# EAGLE design Helmet_Drop_V2.0 (EAGLE 9.6.2)

## Sheet 1 of 3
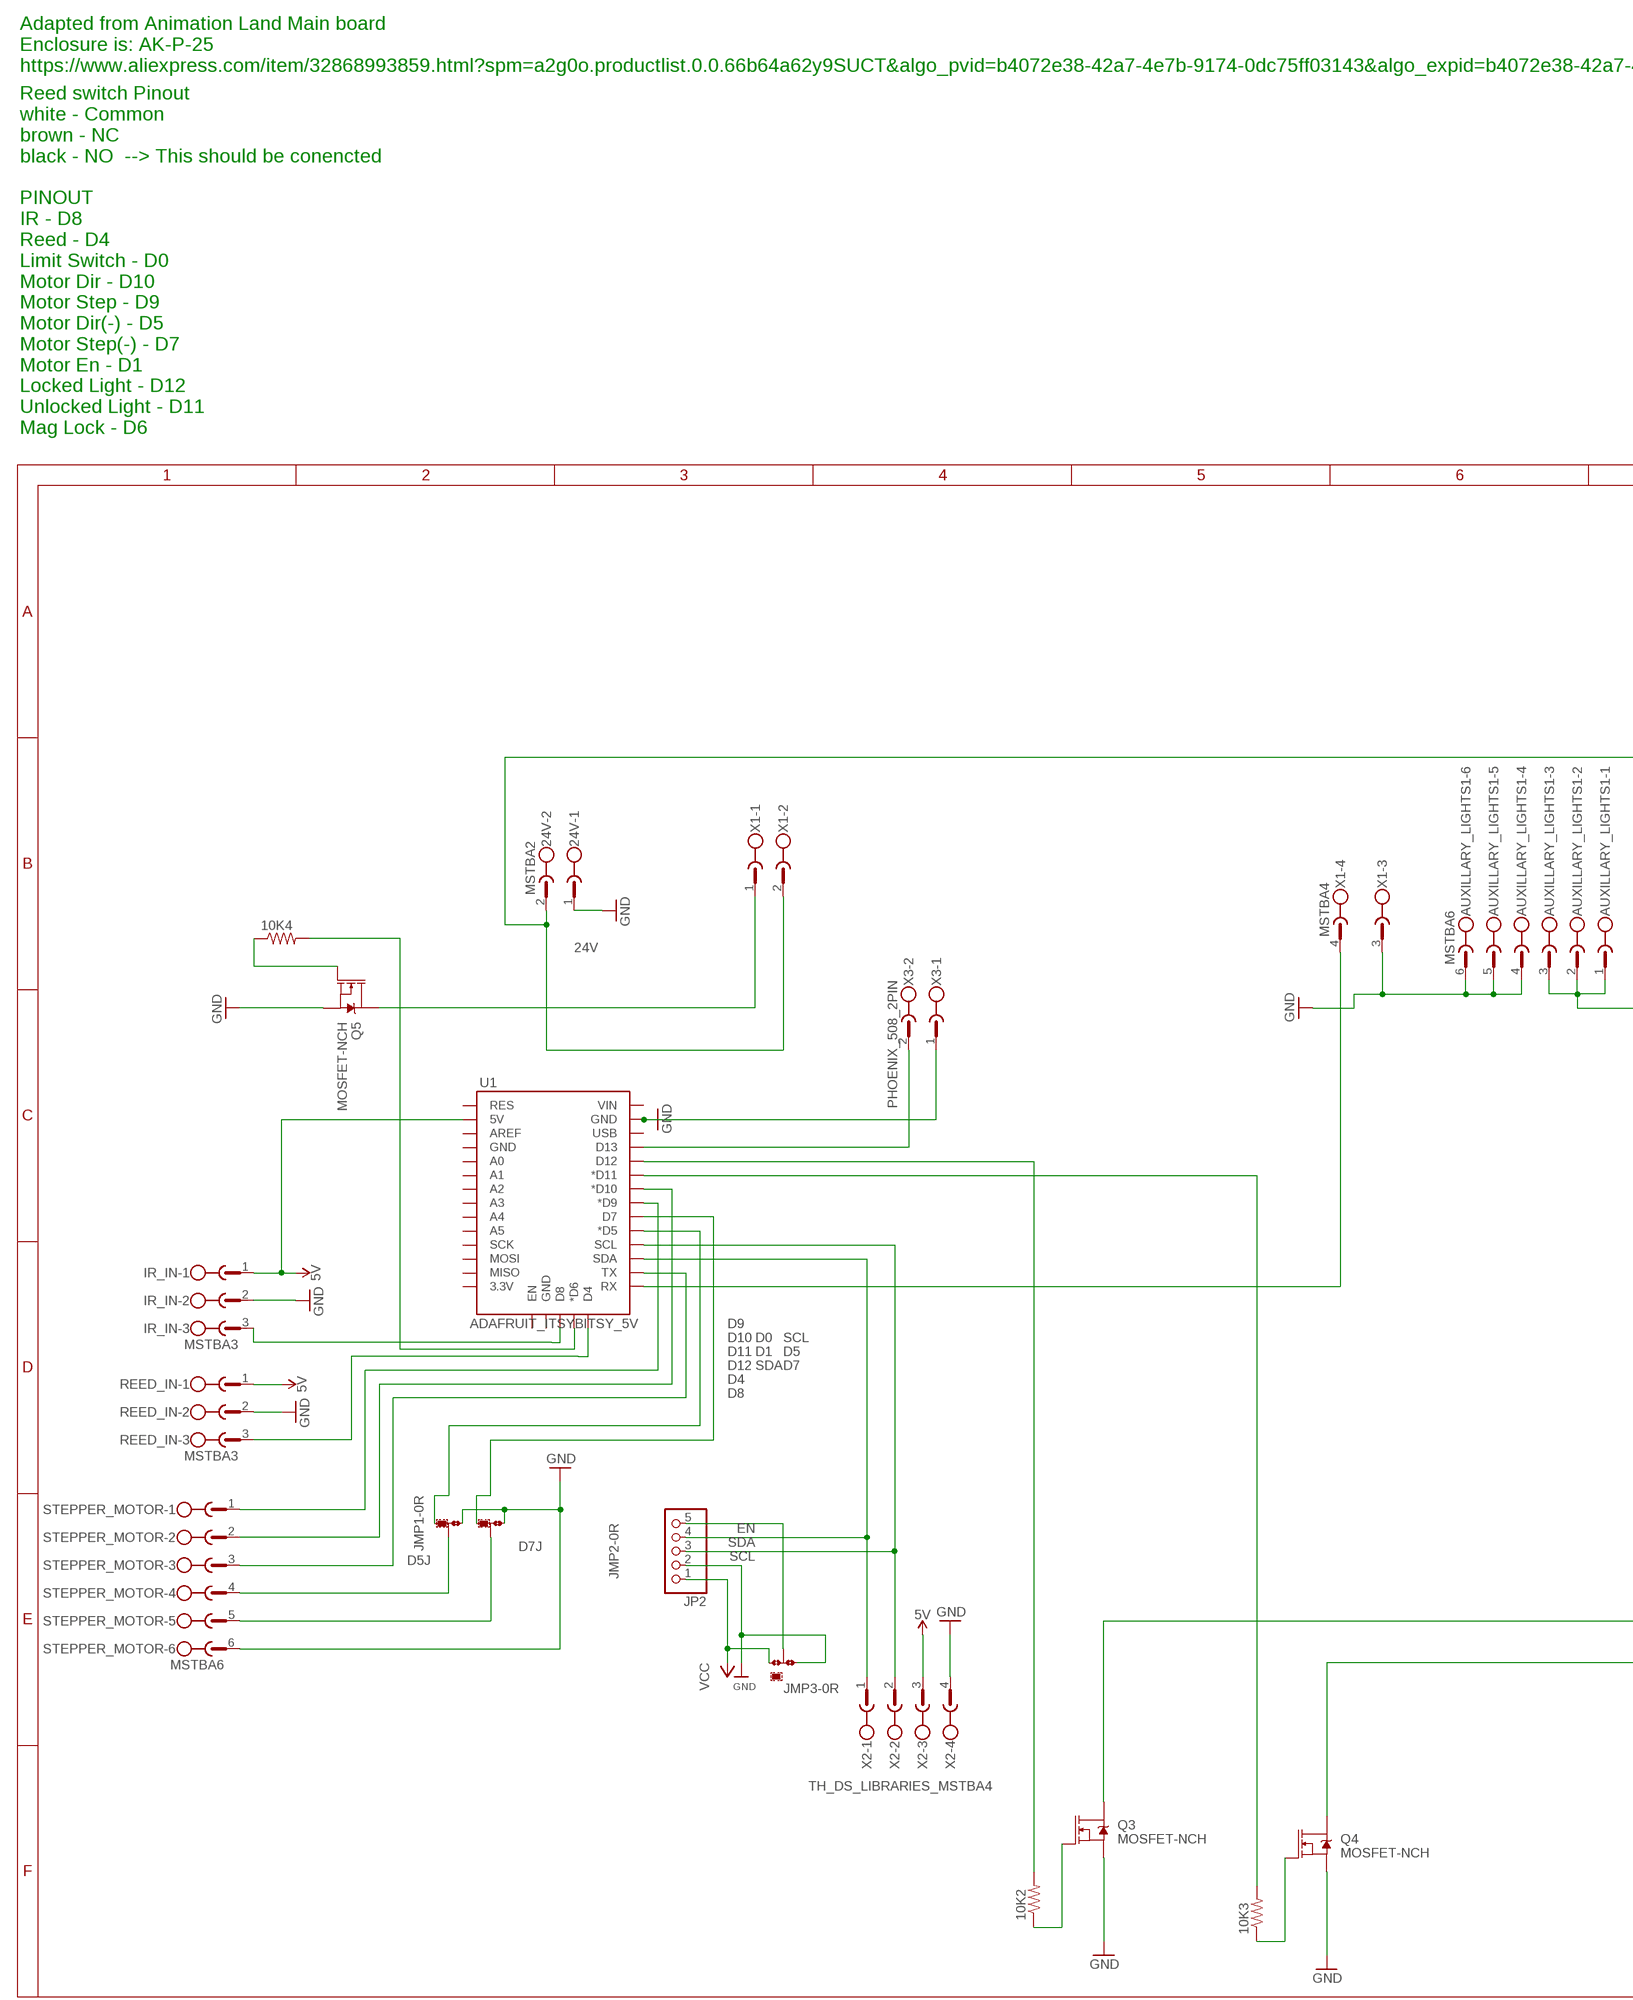
[diagram p0: schematic, sheet 1, part 1 of 2]
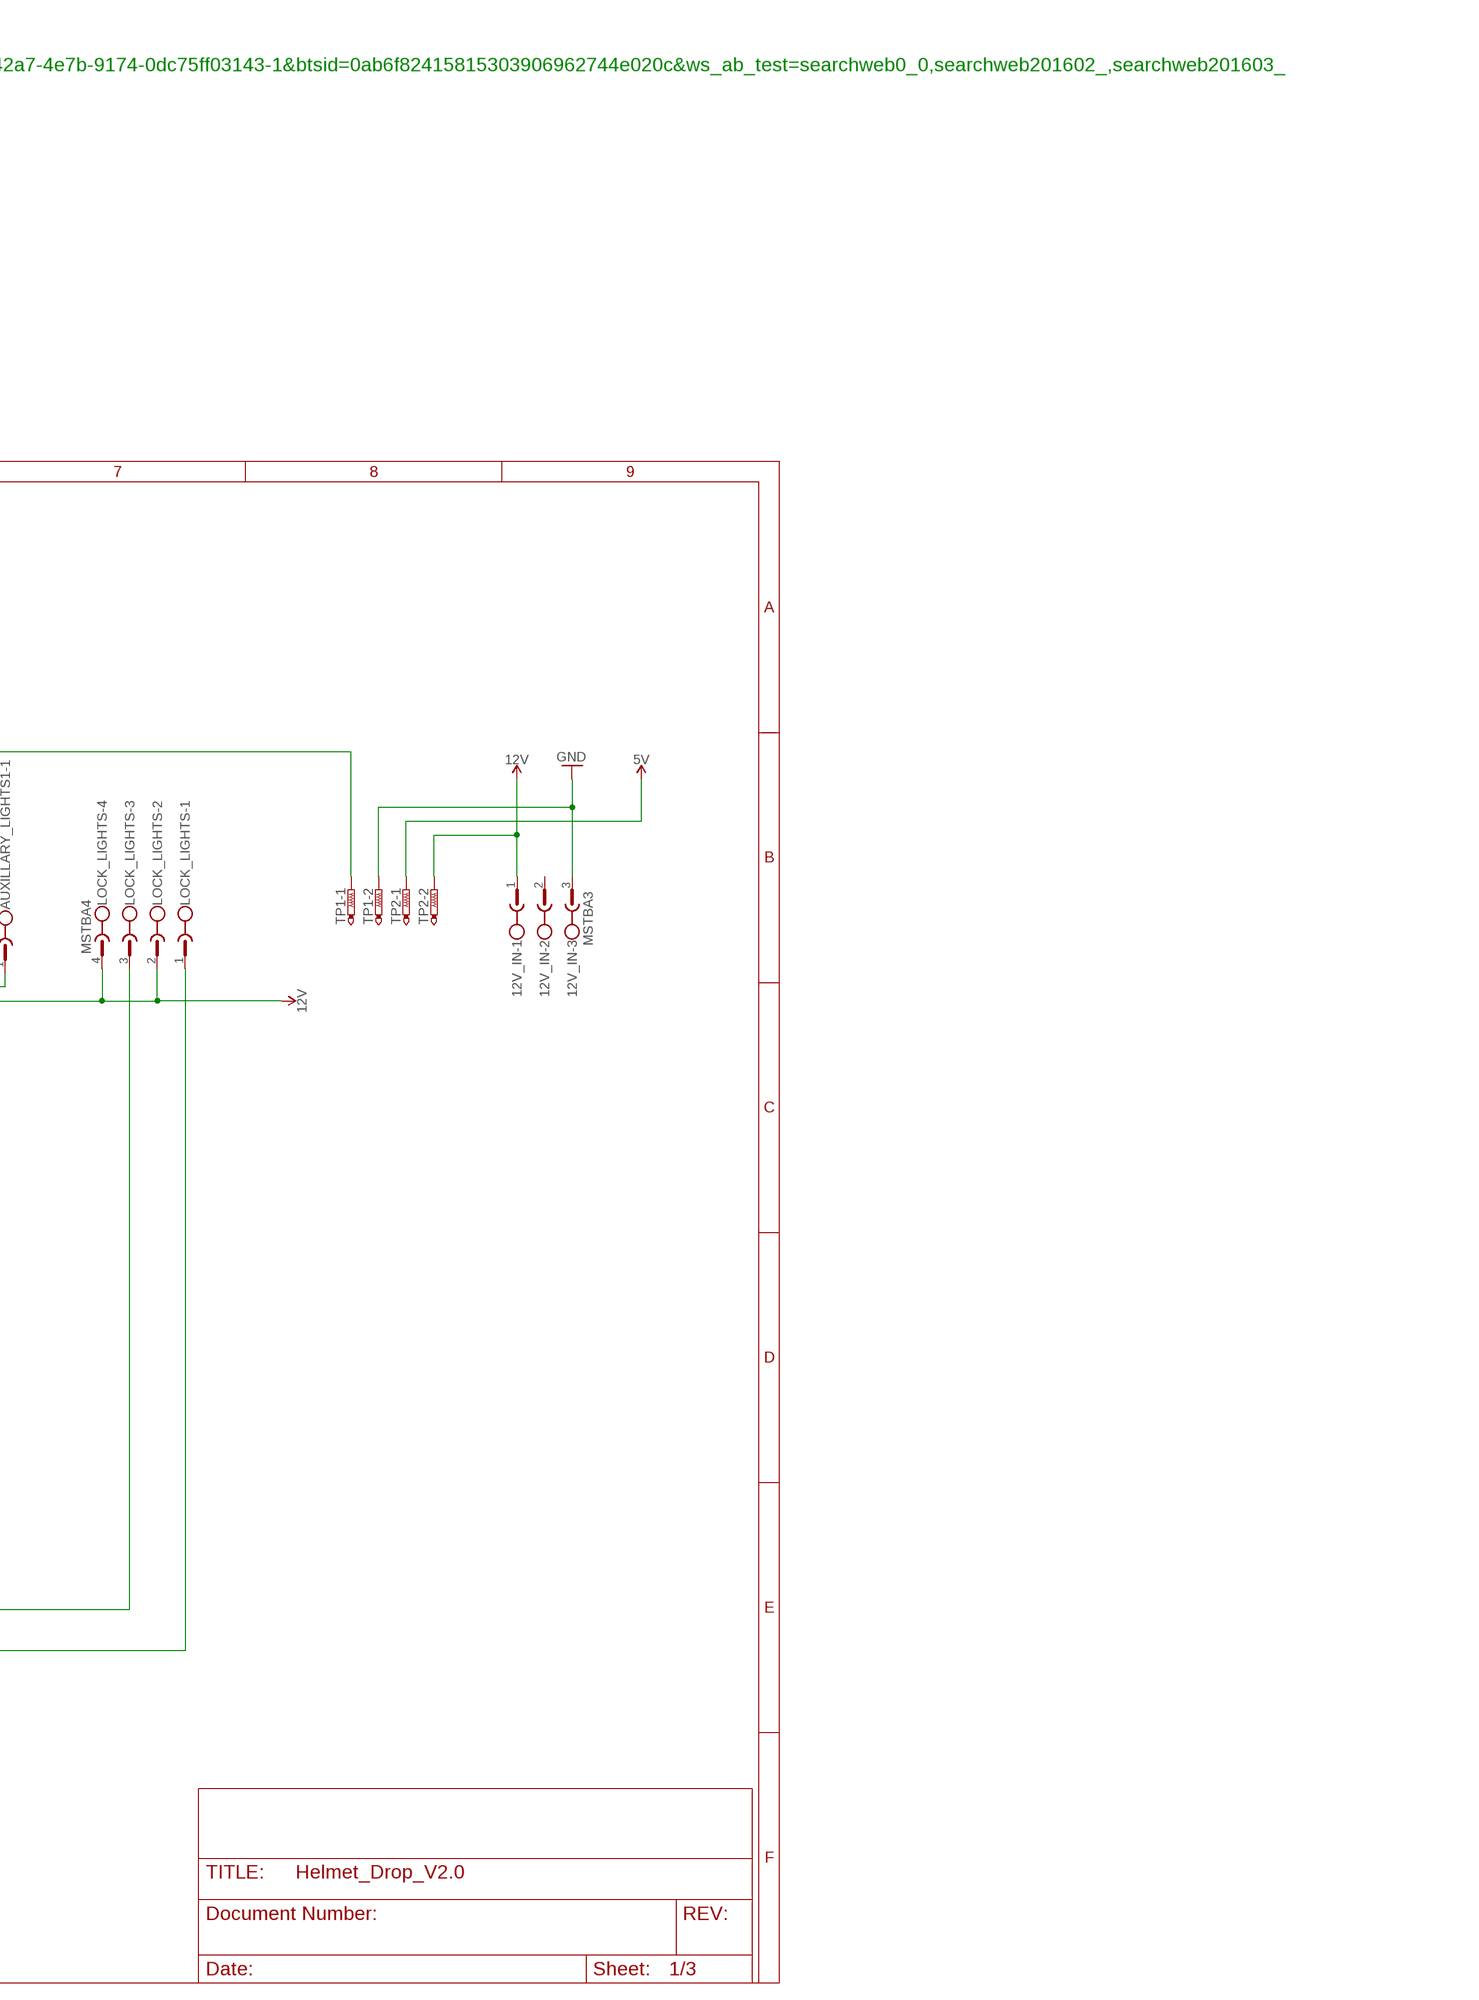
[diagram p1: schematic, sheet 1, part 2 of 2]

### Parts
10K2  R-US_M0805  [M0805]
10K3  R-US_M0805  [M0805]
10K4  R-US_M0805  [M0805]
12V_IN  MSTBA3  [MSTBA3]
24V  MSTBA2  [MSTBA2]
AUXILLARY_LIGHTS1  MSTBA6  [MSTBA6]
IR_IN  MSTBA3  [MSTBA3]
JMP1  0R-JUMPB  [B0R-JMP]
JMP2  0R-JUMPB  [B0R-JMP]
JMP3  0R-JUMPA  [A0R-JMP]
JP2  HEADER-1X570MIL  [1X05_ROUND_70]
LOCK_LIGHTS  MSTBA4  [MSTBA4]
Q3  MOSFET-NCH  [SO-8_POWER_PAK]
Q4  MOSFET-NCH  [SO-8_POWER_PAK]
Q5  MOSFET-NCH  [SO-8_POWER_PAK]
REED_IN  MSTBA3  [MSTBA3]
STEPPER_MOTOR  MSTBA6  [MSTBA6]
TP1  PTR2  [P2-38-17]
TP2  PTR2  [P2-38-17]
U1  ADAFRUIT_ITSYBITSY_5V  [ADAFRUIT_ITSYBITSY]
X1  MSTBA4  [MSTBA4]
X2  TH_DS_LIBRARIES_MSTBA4  [TH_DS_LIBRARIES_MSTBA4]
X3  PHOENIX_508_2PIN  [PHOENIX_508_2PIN]

### Nets
5V [highpower]: IR_IN.1 REED_IN.1 TP2.TP-1 U1.5V X2.3
12V [highpower]: 12V_IN.1 AUXILLARY_LIGHTS1.1 AUXILLARY_LIGHTS1.2 AUXILLARY_LIGHTS1.3 LOCK_LIGHTS.2 LOCK_LIGHTS.4 TP2.TP-2
24V [highpower]: 24V.2 TP1.TP-1 X1.2
D0 [Low Power]: U1.RX X1.4
D1 [Low Power]: STEPPER_MOTOR.3 U1.TX
D4 [Low Power]: REED_IN.3 U1.D4
D5 [Low Power]: JMP1.3 U1.D5(*D5)
D5J [Low Power]: JMP1.2 STEPPER_MOTOR.4
D7 [Low Power]: JMP2.3 U1.D7
D7J [Low Power]: JMP2.2 STEPPER_MOTOR.5
D8 [Low Power]: IR_IN.3 U1.D8
D9 [Low Power]: STEPPER_MOTOR.1 U1.D9(*D9)
D10 [Low Power]: STEPPER_MOTOR.2 U1.D10(*D10)
D11 [Low Power]: 10K3.2 U1.D11(*D11)
D12 [Low Power]: 10K2.2 U1.D12
EN [Low Power]: JMP3.2 JP2.5
GND [highpower]: 12V_IN.3 24V.1 AUXILLARY_LIGHTS1.4 AUXILLARY_LIGHTS1.5 AUXILLARY_LIGHTS1.6 IR_IN.2 JMP1.1 JMP2.1 JMP3.3 JP2.2 Q3.S Q4.S Q5.S REED_IN.2 STEPPER_MOTOR.6 TP1.TP-2 U1.GND@2(GND) X1.3 X2.4 X3.1 ; also sheet 2
N$1 [Low Power]: 10K4.2 U1.D6(*D6)
N$2: U1.D13 X3.2
N$7 [Low Power]: LOCK_LIGHTS.3 Q3.D1(D)
N$10 [Low Power]: LOCK_LIGHTS.1 Q4.D1(D)
N$12 [Low Power]: 10K2.1 Q3.G
N$21 [Low Power]: Q5.D1(D) X1.1
N$27 [Low Power]: 10K3.1 Q4.G
N$28 [Low Power]: 10K4.1 Q5.G
SCL [Low Power]: JP2.3 U1.SCL X2.2
SDA [Low Power]: JP2.4 U1.SDA X2.1
VCC [highpower]: JMP3.1 JP2.1
Unconnected: 12V_IN.2 U1.3V(3.3V) U1.A0 U1.A1 U1.A2 U1.A3 U1.A4 U1.A5 U1.AREF U1.EN U1.GND@0(GND) U1.GND@1(GND) U1.MISO U1.MOSI U1.RES U1.SCK U1.USB U1.VIN

### Notes on the sheet
- Adapted from Animation Land Main board
  Enclosure is: AK-P-25
  https://www.aliexpress.com/item/32868993859.html?spm=a2g0o.productlist.0.0.66b64a62y9SUCT&algo_pvid=b4072e38-42a7-4e7b-9174-0dc75ff03143&algo_expid=b4072e38-42a7-4e7b-9174-0dc75ff03143-1&btsid=0ab6f82415815303906962744e020c&ws_ab_test=searchweb0_0,searchweb201602_,searchweb201603_
- Reed switch Pinout
  white - Common
  brown - NC
  black - NO  --> This should be conencted
  
  PINOUT
  IR - D8
  Reed - D4
  Limit Switch - D0
  Motor Dir - D10
  Motor Step - D9
  Motor Dir(-) - D5
  Motor Step(-) - D7
  Motor En - D1
  Locked Light - D12
  Unlocked Light - D11
  Mag Lock - D6

## Sheet 2 of 3
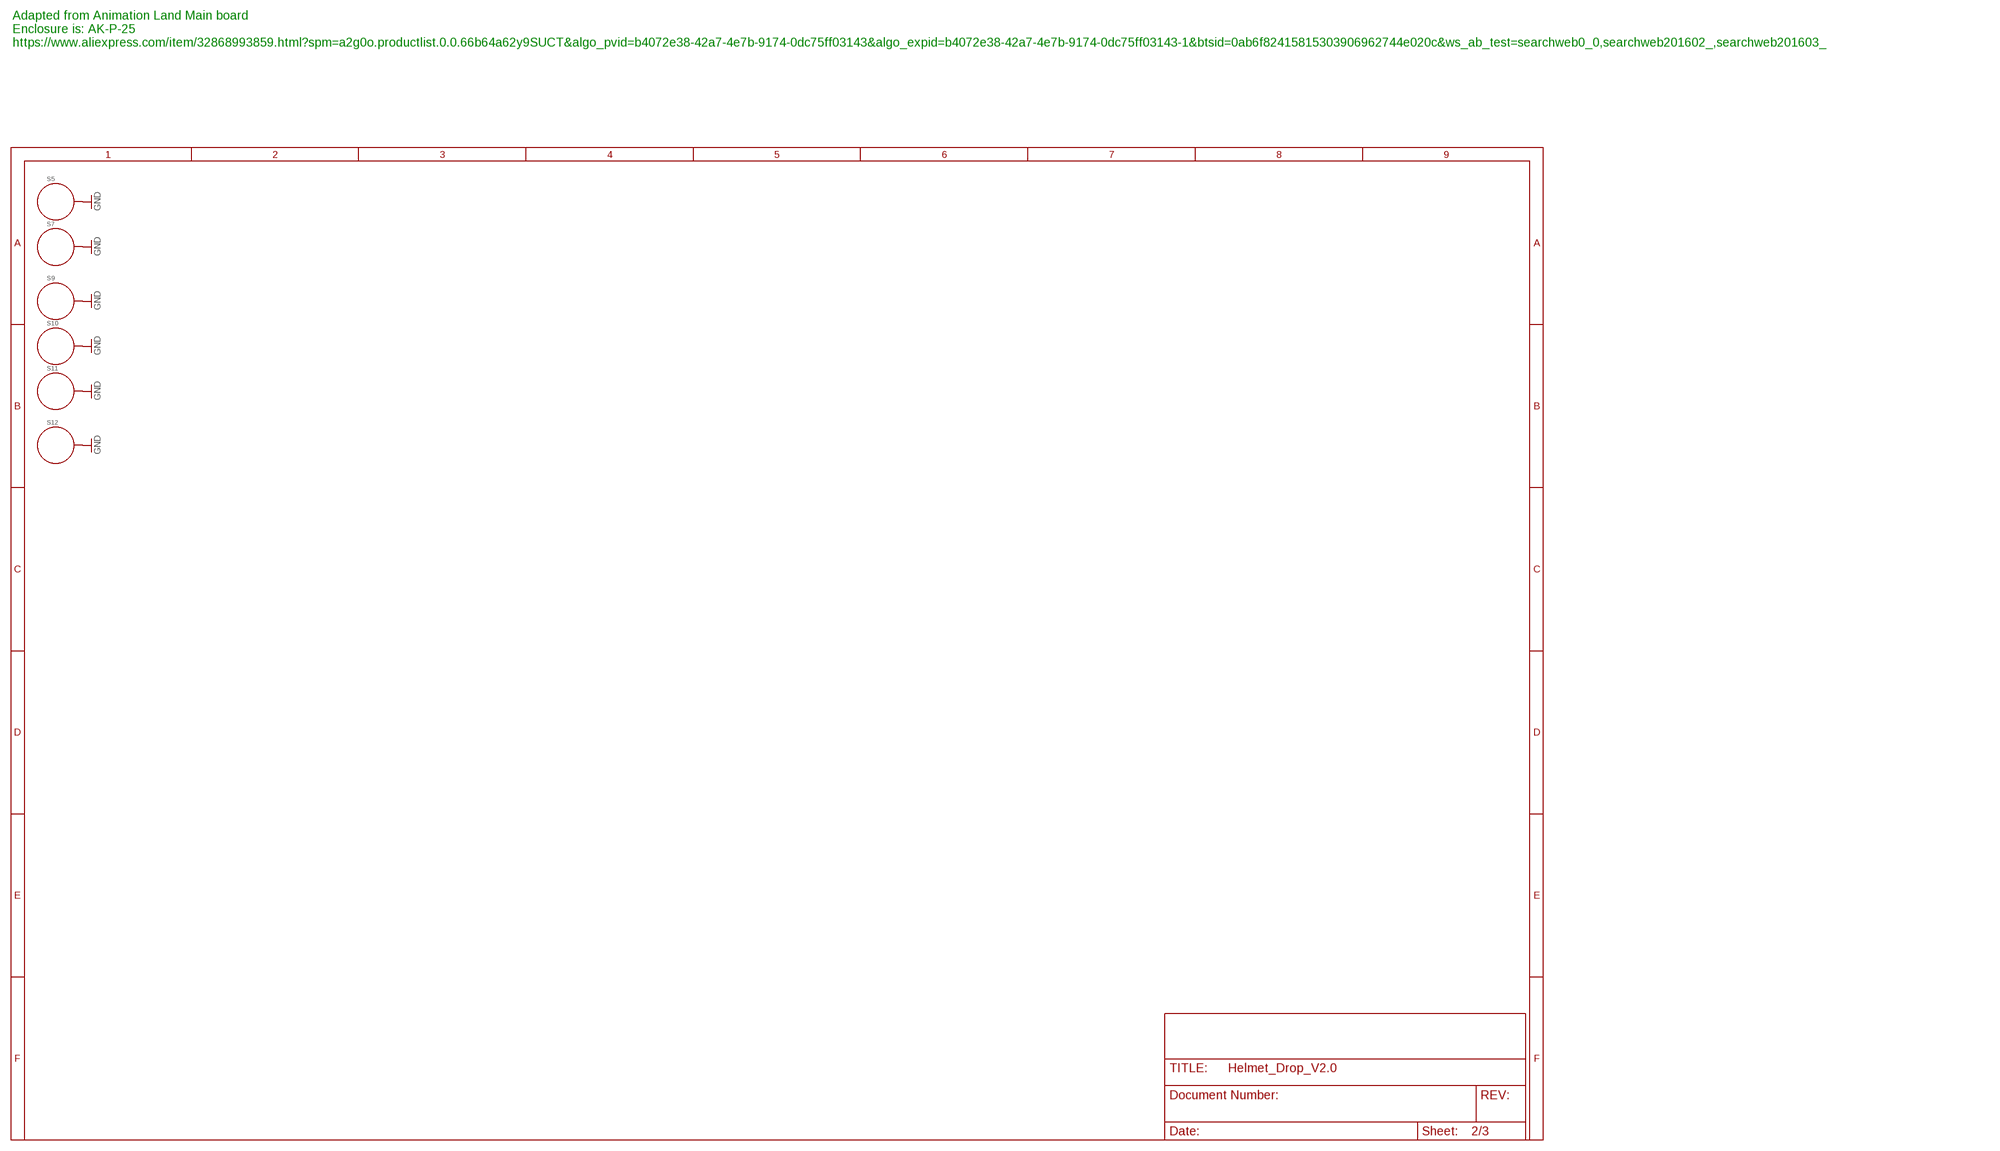
[diagram p2: schematic, sheet 2]

### Parts
S5  STANDOFF_ELECTRICAL5-32  [STANDOFF_ELECTRICAL_5_32]
S7  STANDOFF_ELECTRICAL5-32  [STANDOFF_ELECTRICAL_5_32]
S9  STANDOFF_ELECTRICAL5-32  [STANDOFF_ELECTRICAL_5_32]
S10  STANDOFF_ELECTRICAL5-32  [STANDOFF_ELECTRICAL_5_32]
S11  STANDOFF_ELECTRICAL5-32  [STANDOFF_ELECTRICAL_5_32]
S12  STANDOFF_ELECTRICAL5-32  [STANDOFF_ELECTRICAL_5_32]

### Nets
GND [highpower]: S5.P1 S7.P1 S9.P1 S10.P1 S11.P1 S12.P1 ; also sheet 1

### Notes on the sheet
- Adapted from Animation Land Main board
  Enclosure is: AK-P-25
  https://www.aliexpress.com/item/32868993859.html?spm=a2g0o.productlist.0.0.66b64a62y9SUCT&algo_pvid=b4072e38-42a7-4e7b-9174-0dc75ff03143&algo_expid=b4072e38-42a7-4e7b-9174-0dc75ff03143-1&btsid=0ab6f82415815303906962744e020c&ws_ab_test=searchweb0_0,searchweb201602_,searchweb201603_

## Sheet 3 of 3
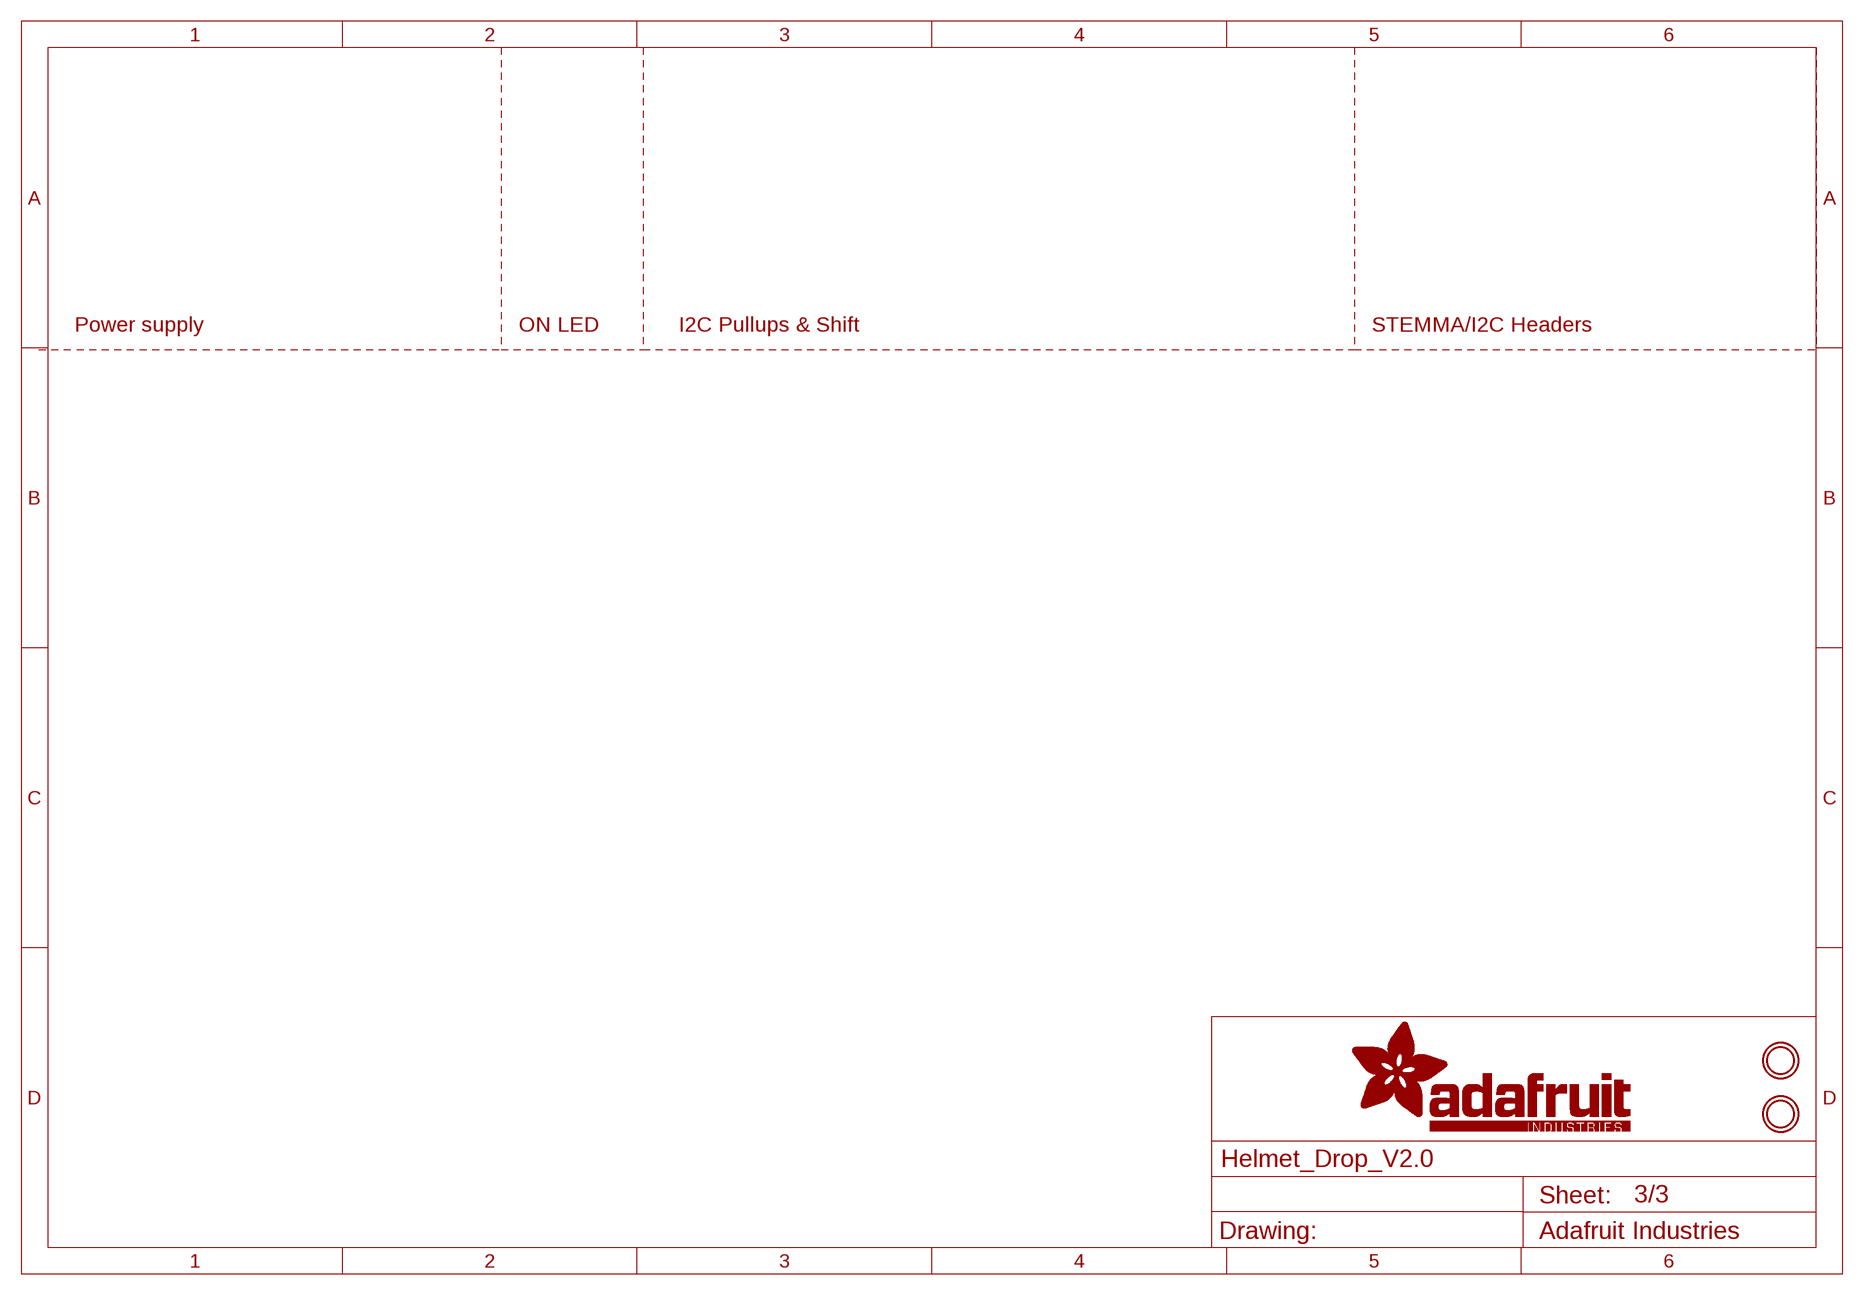
[diagram p3: schematic, sheet 3]

### Parts
U$19  MOUNTINGHOLE2.5  [MOUNTINGHOLE_2.5_PLATED]
U$21  MOUNTINGHOLE2.5  [MOUNTINGHOLE_2.5_PLATED]

### Notes on the sheet
- Power supply | ON LED | I2C Pullups & Shift | STEMMA/I2C Headers

## Library data of the parts
10K2-10K4 = adafruit:R-US_: RESISTOR, American symbol
12V_IN IR_IN REED_IN = con-phoenix-508:MSTBA3: PHOENIX; MF: FARNELL; MPN: 1757255; OC_FARNELL: 3705183; OC_NEWARK: 71C4162
24V = th_libraries:MSTBA2: PHOENIX; MF: FARNELL; MPN: 1757242; OC_FARNELL: 3705171; OC_NEWARK: 71C4161
AUXILLARY_LIGHTS1 STEPPER_MOTOR = con-phoenix-508:MSTBA6: PHOENIX; MF: FARNELL; MPN: 1757284; OC_FARNELL: 3705213; OC_NEWARK: 71C4165
JMP1-JMP3 = jump-0r-smd:0R-JUMP: SMD 0R 0805 Jumper
JP2 = microbuilder:HEADER-1X5: PIN HEADER
LOCK_LIGHTS = th_libraries:MSTBA4: PHOENIX; MF: FARNELL; MPN: 1757268; OC_FARNELL: 3705195; OC_NEWARK: 71C4163
Q3-Q5 = th_ds_libraries:MOSFET-NCH: N-channel MOSFETs from Sparkfun-DiscreteSemi Library
S5 S7 S9-S12 = th_libraries:STANDOFF_ELECTRICAL: A standoff intended to be an electrically connected point. Pad size and stop size allow for a #8 Phillips pan screw head to make a solid connection to the board. Added 144mill drill hole that fits my normal wood screw
TP1 TP2 = testpad:PTR2: TEST PIN
U1 = OMSI_Default_V1:ADAFRUIT_ITSYBITSY_5V: Adafruit ItsyBitsy 32u4 - 5V 16MHz https://www.adafruit.com/product/3677
U$19 U$21 = microbuilder:MOUNTINGHOLE: Mounting Hole For #2 screws (0.086"/2.18mm width, 0.094"/2.4mm hole) use 2.5mm; BOM: EXCLUDE
X1 = con-phoenix-508:MSTBA4: PHOENIX; MF: FARNELL; MPN: 1757268; OC_FARNELL: 3705195; OC_NEWARK: 71C4163
X2 = OMSI_Default_V1:TH_DS_LIBRARIES_MSTBA4: PHOENIX; MF: FARNELL; MPN: 1757268; OC_FARNELL: 3705195; OC_NEWARK: 71C4163
X3 = OMSI_Default_V1:PHOENIX_508_2PIN: PHOENIX; MF: FARNELL; MPN: 1757242; OC_FARNELL: 3705171; OC_NEWARK: 71C4161

## Net classes
1 highpower: width 0.635 mm, drill 0.483 mm, clearance 0.127 mm
2 Low Power: width 0.254 mm, drill 0.483 mm

## Board
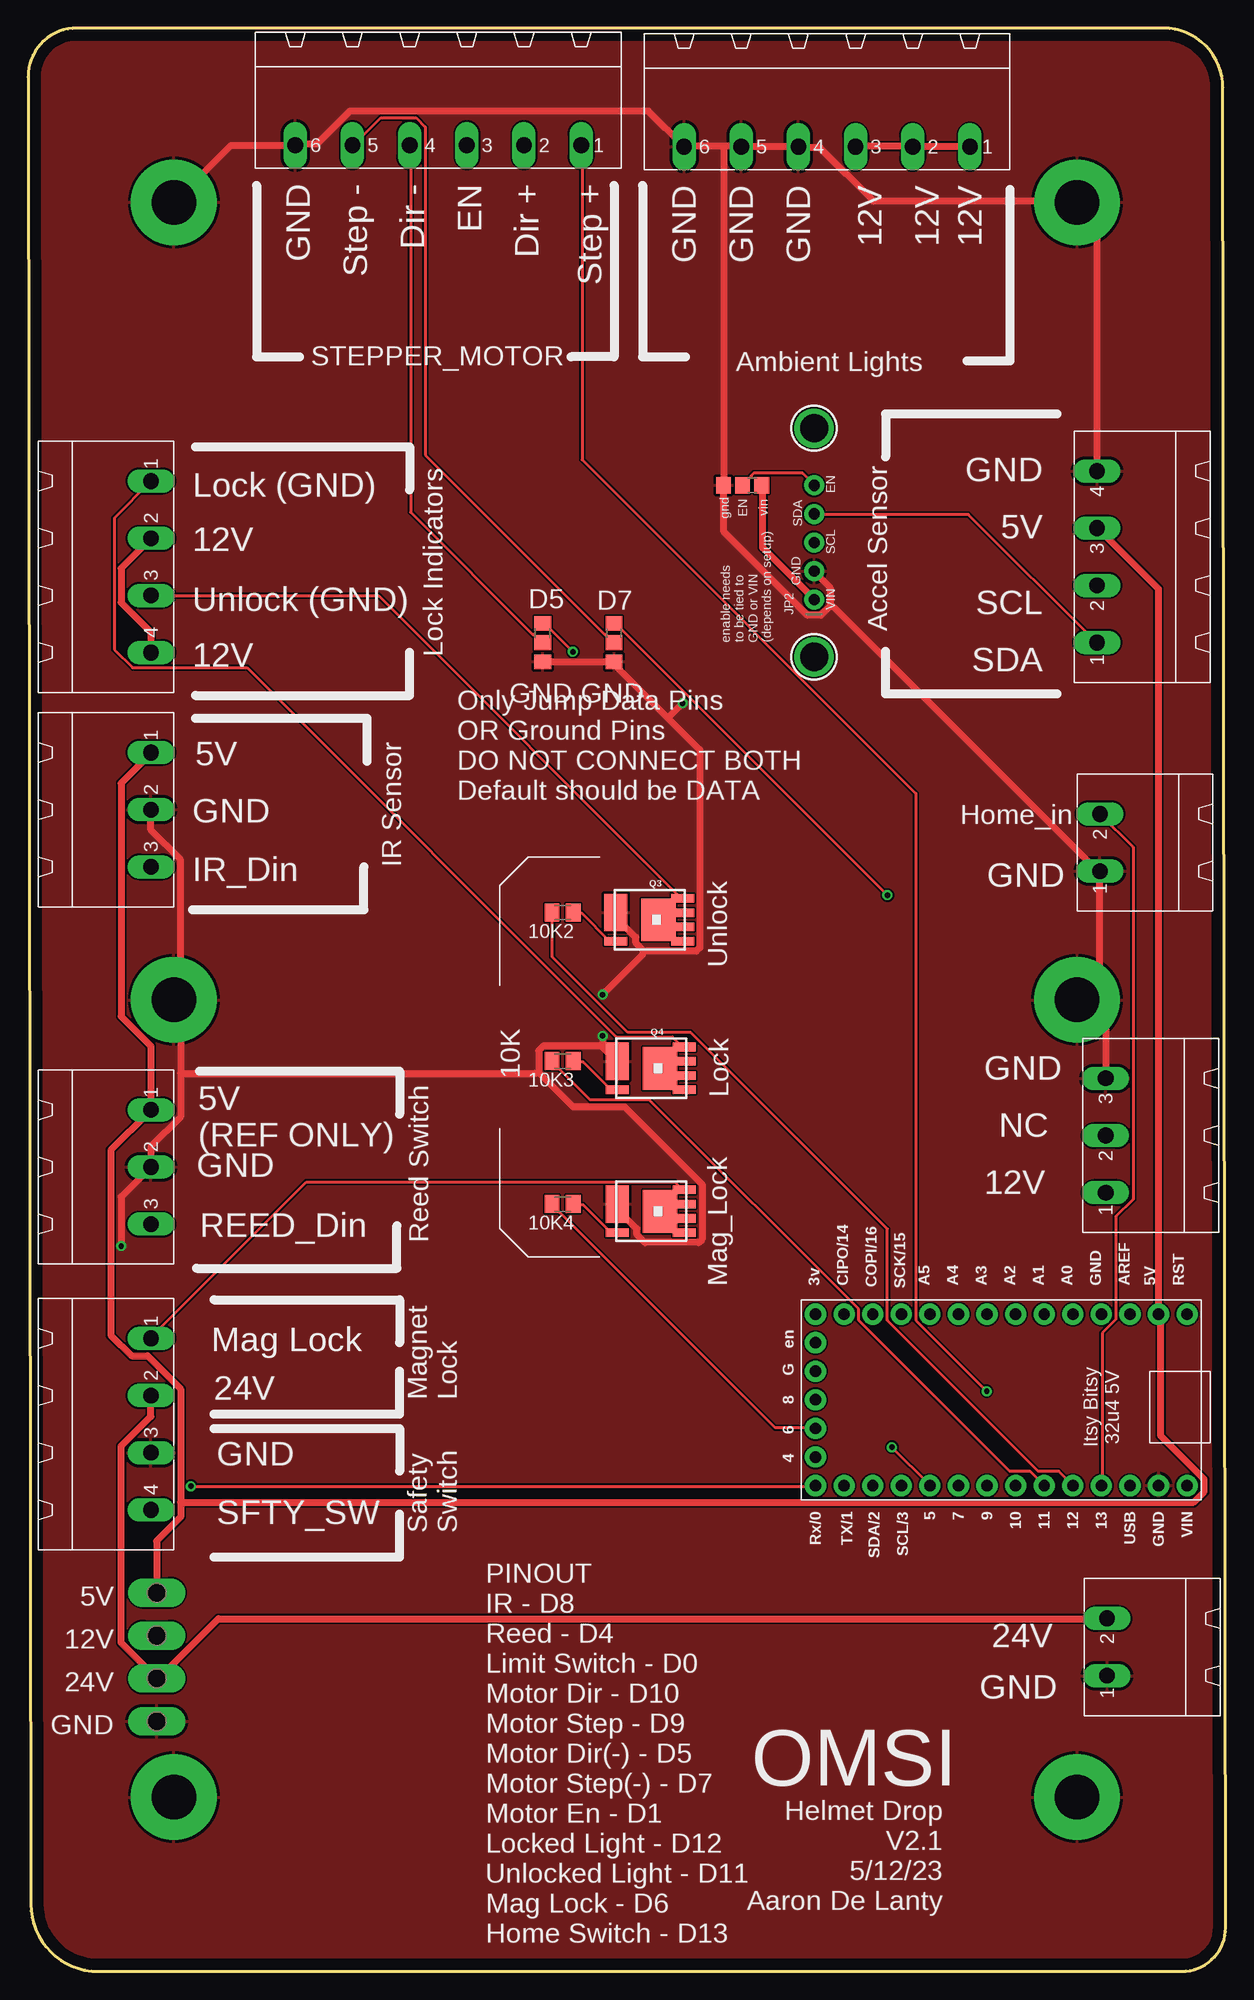
[diagram p4: board, top side]
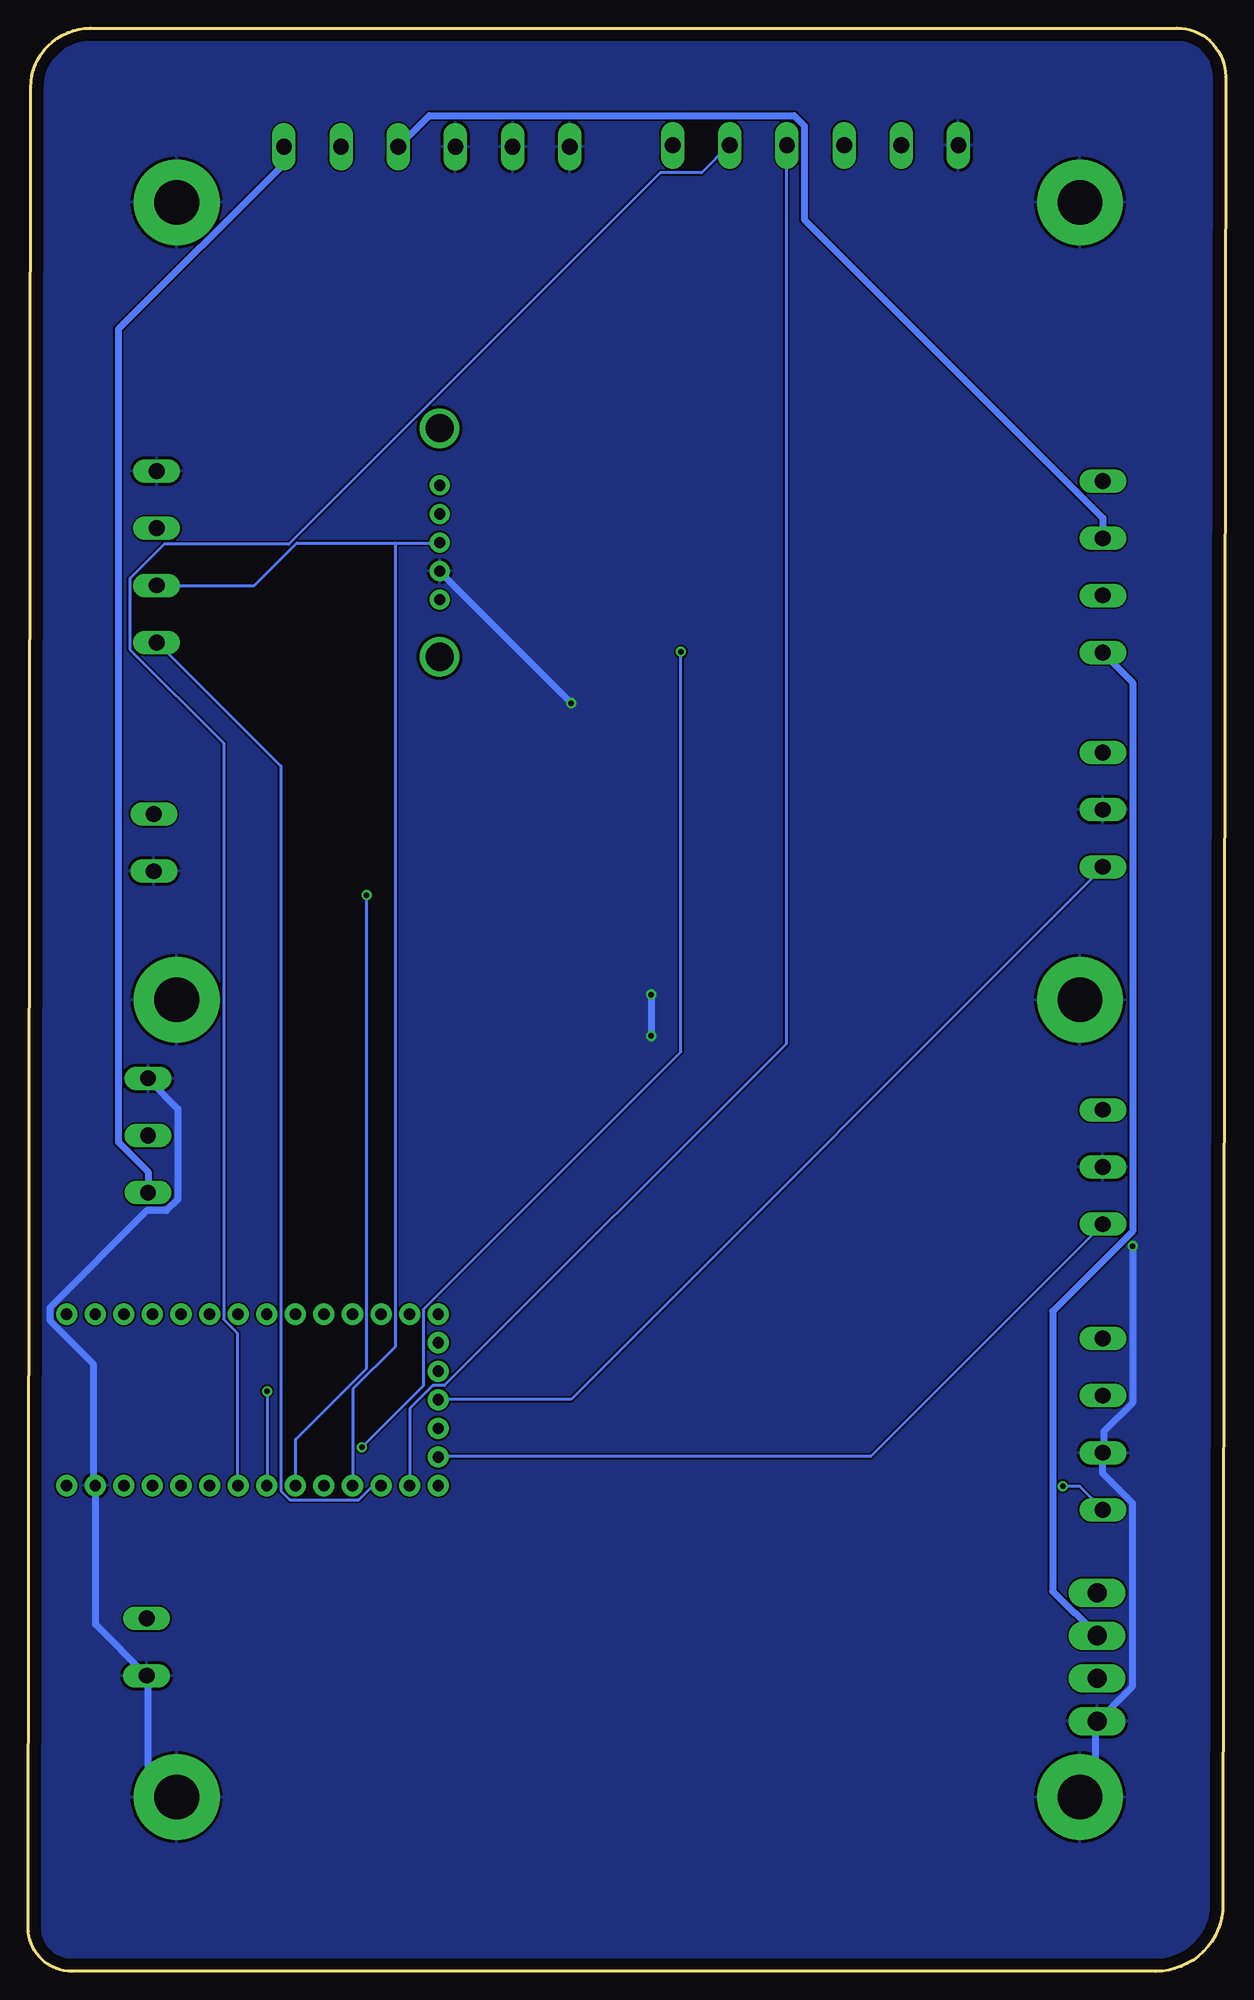
[diagram p5: board, bottom side, seen from below]

Size 106.41 x 172.72 mm. Coordinates in mm from the lower left corner, seen from the top.
Outline: 106.41,3.89 106.17,167.44 arc90 100.89,172.72 4.33,172.72 arc90 0,168.39 0.24,5.97 arc90 6.22,0 102.53,0 arc90 106.41,3.89
Copper layers (1*16): Top 0.035mm / dielectric 1.5mm / Bottom 0.035mm
Design rules "default *": minimum track width 10mil, minimum drill 0.35mm, track to track 6mil, track to pad 6mil, pad to pad 6mil, via to via 6mil, smd to smd 6mil, copper to edge 40mil, drill to drill 6mil, minimum pad ring 10mil, minimum via ring 8mil, stop-mask expansion 4mil, vias tented up to drill 0mil, thermal gap 10mil

### Footprints (pad centres in the part's own frame; a part is rotated, then mirrored left to right if it is on the bottom)
M0805 = smd 1.3 x 1.6: 1 -0.95,0; 2 0.95,0
MSTBA3 = drill 1.397 long: 1 -5.08,5.08; 2 0,5.08; 3 5.08,5.08
MSTBA2 = drill 1.397 long: 1 -2.54,5.08; 2 2.54,5.08
MSTBA6 = drill 1.397 long: 1 -12.7,5.08; 2 -7.62,5.08; 3 -2.54,5.08; 4 2.54,5.08; 5 7.62,5.08; 6 12.7,5.08
B0R-JMP = smd 1.5 x 1.3: 1 0,1.7; 2 0,0; 3 0,-1.7
A0R-JMP = smd 1.5 x 1.3: 1 0,1.7; 2 0,0; 3 0,-1.7
1X05_ROUND_70 = drill 1 pad 1.778: 1 -5.08,0; 2 -2.54,0; 3 0,0; 4 2.54,0; 5 5.08,0
MSTBA4 = drill 1.397 long: 1 -7.62,5.08; 2 -2.54,5.08; 3 2.54,5.08; 4 7.62,5.08
SO-8_POWER_PAK = smd 0.762 x 2.032: D1 -3.423,2.437; D2 -2.153,2.437; D3 -0.883,2.437; D4 0.387,2.437; G 0.387,-3.532 | smd 3.81 x 3.048: D5 -1.518,0.278 | smd 3.302 x 2.032: S -2.153,-3.532
STANDOFF_ELECTRICAL_5_32 = drill 3.969 pad 7.62: P1 0,0
P2-38-17 = drill 1.702 pad 2.121 long: TP-1 -1.905,0; TP-2 1.905,0
ADAFRUIT_ITSYBITSY = drill 1.016 pad 1.88: 3V -7.62,-16.51; 5V -7.62,13.97; A0 -7.62,6.35; A1 -7.62,3.81; A2 -7.62,1.27; A3 -7.62,-1.27; A4 -7.62,-3.81; A5 -7.62,-6.35; AREF -7.62,11.43; D4 5.08,-16.51; D5 7.62,-6.35; D6 2.54,-16.51; D7 7.62,-3.81; D8 0,-16.51; D9 7.62,-1.27; D10 7.62,1.27; D11 7.62,3.81; D12 7.62,6.35; D13 7.62,8.89; EN -5.08,-16.51; GND@0 -7.62,8.89; GND@1 -2.54,-16.51; GND@2 7.62,13.97; MISO -7.62,-13.97; MOSI -7.62,-11.43; RES -7.62,16.51; RX 7.62,-16.51; SCK -7.62,-8.89; SCL 7.62,-8.89; SDA 7.62,-11.43; TX 7.62,-13.97; USB 7.62,11.43; VIN 7.62,16.51
MOUNTINGHOLE_2.5_PLATED = drill 2.5 pad 3.2: P$1 0,0
TH_DS_LIBRARIES_MSTBA4 = drill 1.397 long: 1 -7.62,5.08; 2 -2.54,5.08; 3 2.54,5.08; 4 7.62,5.08
PHOENIX_508_2PIN = drill 1.397 long: 1 -2.54,5.08; 2 2.54,5.08

### Placement (x,y rotation side)
10K2  47.49,94.11 180 top
10K3  47.49,80.9 180 top
10K4  47.49,68.2 180 top
12V_IN  100.83,74.3 90 top
24V  100.96,28.83 90 top
AUXILLARY_LIGHTS1  70.99,167.26 180 top
IR_IN  5.84,103.25 270 top
JMP1  45.71,118.11 180 top
JMP2  52.06,118.11 180 top
JMP3  63.49,132.08 270 top
JP2  69.84,127 90 top
LOCK_LIGHTS  5.84,124.84 270 top
Q3  55.75,91.95 270 top
Q4  55.87,78.74 270 top
Q5  55.87,66.04 270 top
REED_IN  5.84,71.5 270 top
S5  93.21,157.23 270 top
S7  12.95,86.36 270 top
S9  12.95,157.23 270 top
S10  93.21,86.36 270 top
S11  12.95,15.49 270 top
S12  93.21,15.49 270 top
STEPPER_MOTOR  36.44,167.39 180 top
TP1  11.42,24.13 270 top
TP2  11.42,31.75 270 top
U1  86.48,50.8 270 top
U$19  69.84,116.84 90 top
U$21  69.84,137.16 90 top
X1  5.84,48.64 270 top
X2  100.07,125.73 90 top
X3  100.32,100.33 90 top

### Tracks (layer width: path | path; a pad name or v marks a point on that pad's centre or on a via)
5V
  Top 0.635: X2.3 95.04,128.27 100.43,122.89 100.43,58.47 U1.5V 100.63,58.17 100.63,47.6 104.49,43.74 104.49,42.62 103.57,41.71 13.56,41.71 | IR_IN.1 10.92,108.26 8.27,105.61 8.27,84.89 10.92,82.25 REED_IN.1 10.71,76.35 7.36,73 7.36,56.54 9.19,54.71 10.61,54.71 13.56,51.76 13.56,41.71 | TP2.TP-1 11.42,38.25 13.56,40.39 13.56,41.71
12V
  Top 0.635: LOCK_LIGHTS.4 10.92,119.02 8.27,121.67 8.27,124.71 10.92,127.36 LOCK_LIGHTS.2 | AUXILLARY_LIGHTS1.3 73.6,162.2 78.58,162.2 AUXILLARY_LIGHTS1.2 78.89,162.2 83.66,162.2 AUXILLARY_LIGHTS1.1
  Bottom 0.635: TP2.TP-2 11.42,29.92 13.35,31.85 13.46,31.85 15.39,33.78 15.39,58.67 8.27,65.79 8.27,114.55 10.92,117.2 LOCK_LIGHTS.4 | 12V_IN.1 95.75,71.07 98.39,73.71 98.39,145.95 83.76,160.58 83.76,162.1 AUXILLARY_LIGHTS1.1 | LOCK_LIGHTS.2 10.92,129.18 37.43,155.7 37.43,164.03 38.35,164.95 70.76,164.95 AUXILLARY_LIGHTS1.3
24V
  Top 0.635: X1.2 10.92,49.33 8.27,46.68 8.27,29.21 11.42,26.06 TP1.TP-1 11.73,26.16 16.91,31.34 95.85,31.34 24V.2
D0  (via drill 0.48)
  Top 0.254: v14.47,43.13 69.95,43.13 U1.RX
  Bottom 0.254: v14.47,43.13 12.95,43.13 10.92,41.1 X1.4
D1
  Bottom 0.254: U1.TX 72.49,43.23 72.49,50.04 70.45,52.07 69.44,52.07 39.06,82.45 39.06,162.31 STEPPER_MOTOR.3
D4
  Bottom 0.254: U1.D4 69.95,45.77 31.54,45.77 10.92,66.4 REED_IN.3
D5  (via drill 0.48)
  Top 0.254: v48.41,117.3 45.97,119.74 45.76,119.74 JMP1.3 | v76.75,46.58 80.11,43.23 U1.D5
  Bottom 0.254: v48.41,117.3 48.41,81.74 71.27,58.88 71.27,52.07 v76.75,46.58
D5J
  Top 0.254: JMP1.2 45.66,118.11 44.95,118.82 44.85,118.82 33.98,129.69 33.98,162.31 STEPPER_MOTOR.4
D7  (via drill 0.48)
  Top 0.254: v76.35,95.66 52.27,119.74 52.06,119.74 JMP2.3
  Bottom 0.254: v76.35,95.66 76.35,53.59 82.65,47.29 82.65,43.23 U1.D7
D7J
  Top 0.254: JMP2.2 51.35,118.82 51.25,118.82 35.3,134.77 35.3,163.93 34.49,164.74 31.34,164.74 28.9,162.31 STEPPER_MOTOR.5
D8
  Bottom 0.254: U1.D8 69.95,50.85 58.16,50.85 10.92,98.09 IR_IN.3
D9  (via drill 0.48)
  Top 0.254: v85.19,51.56 78.89,57.86 78.89,104.7 49.22,134.37 49.22,162.31 STEPPER_MOTOR.1
  Bottom 0.254: v85.19,51.56 85.19,43.23 U1.D9
D10
  Bottom 0.254: U1.D10 87.83,43.23 87.83,56.74 89.05,57.96 89.05,109.17 97.38,117.5 97.38,123.8 94.33,126.85 83.25,126.85 50.23,159.87 46.58,159.87 44.14,162.31 STEPPER_MOTOR.2
D11
  Top 0.254: 10K3.2 46.58,80.82 49.93,77.47 55.21,77.47 73.81,58.88 73.81,57.86 87.22,44.45 89.05,44.45 90.27,43.23 U1.D11
D12
  Top 0.254: 10K2.2 46.58,94.03 46.58,90.17 53.28,83.46 58.87,83.46 76.35,65.99 76.35,57.86 89.76,44.45 91.59,44.45 92.81,43.23 U1.D12
EN
  Top 0.254: JMP3.2 64.26,132.84 64.26,132.94 64.46,133.15 68.83,133.15 69.84,132.13 JP2.5
GND  (via drill 0.48)
  Top 0.635: 45.36,79.91 48.41,76.86 52.98,76.86 59.89,69.95 59.89,65.08 59.58,64.77 54.81,64.77 54.1,65.48 54.1,65.99 52.37,67.72 52.37,68.12 Q5.S | 45.36,79.91 45.36,81.84 45.76,82.25 50.95,82.25 | 50.95,82.25 52.27,80.92 Q4.S | 13.56,79.81 13.56,85.7 12.95,86.31 S7.P1 13.05,86.61 13.56,87.12 13.56,98.81 10.92,101.45 IR_IN.2 | 13.56,79.81 13.56,75.95 10.92,73.3 REED_IN.2 10.71,71.27 8.27,68.83 v8.27,64.47 | 13.56,79.81 45.05,79.81 45.36,79.91 | 12V_IN.3 95.75,83.77 93.21,86.31 S10.P1 93.31,86.61 95.24,88.54 X3.1 94.94,97.89 71.57,121.26 71.27,121.36 | S9.P1 18.03,162.31 STEPPER_MOTOR.6 24.02,162.41 25.65,162.41 28.59,165.35 55.11,165.35 AUXILLARY_LIGHTS1.6 58.36,162.2 61.82,162.2 | JMP1.1 45.76,116.38 52.06,116.38 JMP2.1 52.17,116.08 56.84,111.4 | 54.71,90.68 53.99,91.39 53.99,91.9 52.27,93.62 52.27,94.03 Q3.S | 54.71,90.68 59.38,90.68 59.68,90.98 59.68,108.56 56.84,111.4 | 71.27,121.36 70.45,120.55 69.23,120.55 61.82,127.97 61.82,132.03 JMP3.3 61.82,132.33 61.82,162.2 | 71.27,121.36 71.27,122.99 69.84,124.41 JP2.2 | 61.82,162.2 63.34,162.2 AUXILLARY_LIGHTS1.5 63.65,162.2 68.42,162.2 AUXILLARY_LIGHTS1.4 68.73,162.1 70.35,162.1 75.13,157.33 92.91,157.33 S5.P1 94.94,155.5 94.94,133.35 X2.4 | v58.16,112.73 56.84,111.4 | v51.05,83.16 51.05,82.55 50.95,82.25 | v51.05,86.82 54.6,90.37 54.71,90.68
  Bottom 0.635: S11.P1 11.53,16.92 11.53,21.89 TP1.TP-2 11.42,22.2 8.27,25.35 8.27,41.6 10.92,44.25 X1.3 10.81,46.38 10.81,48.01 8.27,50.55 v8.27,64.47 | S12.P1 95.75,18.03 95.75,26.06 24V.1 100.43,30.84 100.43,43.13 U1.GND@2 100.63,43.43 100.63,54 104.49,57.86 104.49,58.98 95.85,67.62 94.13,67.62 93.11,68.63 93.11,76.66 95.75,79.3 12V_IN.3 | v58.16,112.73 69.84,124.41 JP2.2 | v51.05,86.82 v51.05,83.16
  pour Top: -2.55,175.26 109.21,175.26 110.48,173.99 110.48,-3.81 6.34,-3.81 5.07,-5.08 -0.01,-5.08 -11.44,6.35 -11.44,167.64 -6.36,172.72
  pour Bottom: -6.36,158.75 -6.36,172.72 -0.01,179.07 102.86,179.07 111.75,170.18 111.75,3.81 102.86,-5.08 -0.01,-5.08 -2.55,-2.54 -2.55,156.21 -3.82,157.48
N$1
  Top 0.254: 10K4.2 46.58,68.12 66.39,48.31 69.95,48.31 U1.D6
N$2
  Top 0.254: X3.2 98.19,99.92 98.19,68.63 96.67,67.11 96.67,57.96 95.45,56.74 95.45,43.23 U1.D13
N$7
  Top 0.254: Q3.D1 58.16,95.45 57.96,95.45 31.13,122.28 10.92,122.28 LOCK_LIGHTS.3
N$10
  Top 0.254: Q4.D1 58.26,82.25 58.06,82.25 57.25,83.06 52.27,83.06 19.45,115.88 9.29,115.88 7.66,117.5 7.66,129.18 10.92,132.44 LOCK_LIGHTS.1
N$12
  Top 0.254: 10K2.1 48.51,94.03 49.22,94.03 51.66,91.59 52.17,91.59 Q3.G
N$21
  Top 0.254: Q5.D1 58.26,69.55 58.06,69.55 57.45,70.16 24.73,70.16 10.92,56.34 X1.1
N$27
  Top 0.254: 10K3.1 48.51,80.82 49.32,80.82 51.76,78.38 52.27,78.38 Q4.G
N$28
  Top 0.254: 10K4.1 48.51,68.12 49.32,68.12 51.76,65.68 52.27,65.68 Q5.G
SCL
  Bottom 0.254: 73.81,126.95 82.54,126.95 86.3,123.19 X2.2 | 73.81,126.95 69.84,126.95 JP2.3 | 73.81,126.95 73.81,55.52 77.57,51.76 77.57,43.23 U1.SCL
SDA
  Top 0.254: JP2.4 69.84,129.49 83.56,129.49 94.94,118.11 X2.1
  Bottom 0.254: U1.SDA 75.13,43.13 75.84,43.13 77.06,41.91 83.15,41.91 83.97,42.72 83.97,107.14 94.94,118.11 X2.1
VCC
  Top 0.635: JMP3.1 65.27,132.03 65.27,126.54 69.84,121.97 JP2.1

### Text on the board
tPlace: EN | SDA | SCL | GND | VIN
tNames: GND | Step - | Dir - | EN | Dir + | Step + | GND | GND | GND | 12V | 12V | 12V | Ambient Lights | GND | Lock (GND) | gnd | EN | vin | 5V | 12V | D5 | D7 | SCL | Unlock (GND) | Accel Sensor | enable needs / to be tied to / GND or VIN / (depends on setup) | SDA | Lock Indicators | 12V | GND | GND | 5V | Only Jump Data Pins / OR Ground Pins / DO NOT CONNECT BOTH / Default should be DATA | GND | Home_in | IR Sensor | IR_Din | Unlock | GND | 10K | Lock | GND | 5V / (REF ONLY) | NC | Mag_Lock | GND | 12V | REED_Din | Reed Switch | Mag Lock | 24V | Magnet / Lock | GND | SFTY_SW | Safety / Switch | 5V | 12V | 24V | 24V | GND | GND | OMSI | Helmet Drop / V2.1 / 5/12/23 / Aaron De Lanty | PINOUT / IR - D8 / Reed - D4 / Limit Switch - D0 / Motor Dir - D10 / Motor Step - D9 / Motor Dir(-) - D5 / Motor Step(-) - D7 / Motor En - D1 / Locked Light - D12 / Unlocked Light - D11 / Mag Lock - D6 / Home Switch - D13